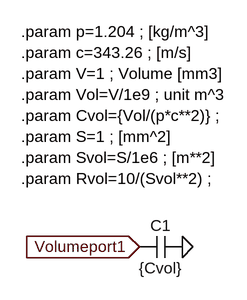
[diagram p0: schematic VolumeModel.asc]
VolumeModel.asc, the LTspice schematic file:
Version 4
SHEET 1 1216 680
FLAG 384 480 Volumeport1
IOPIN 384 480 In
FLAG 448 480 0
SYMBOL cap 448 464 R90
WINDOW 0 0 32 VBottom 2
WINDOW 3 32 32 VTop 2
SYMATTR InstName C1
SYMATTR Value {Cvol}
SYMATTR SpiceLine Rpar={Rvol}
TEXT 208 160 Left 2 !.param p=1.204 ; [kg/m^3]\n.param c=343.26 ; [m/s]\n.param V=1 ; Volume [mm3]\n.param Vol=V/1e9 ; unit m^3\n.param Cvol={Vol/(p*c**2)} ;\n.param S=1 ; [mm^2]\n.param Svol=S/1e6 ; [m**2]\n.param Rvol=10/(Svol**2) ;

The netlist it stands for:
* VolumeModel.asc
C1 0 Volumeport1 {Cvol} Rpar={Rvol}
.param p=1.204 ; [kg/m^3]
.param c=343.26 ; [m/s]
.param V=1 ; Volume [mm3]
.param Vol=V/1e9 ; unit m^3
.param Cvol={Vol/(p*c**2)} ;
.param S=1 ; [mm^2]
.param Svol=S/1e6 ; [m**2]
.param Rvol=10/(Svol**2) ;
.backanno
.end